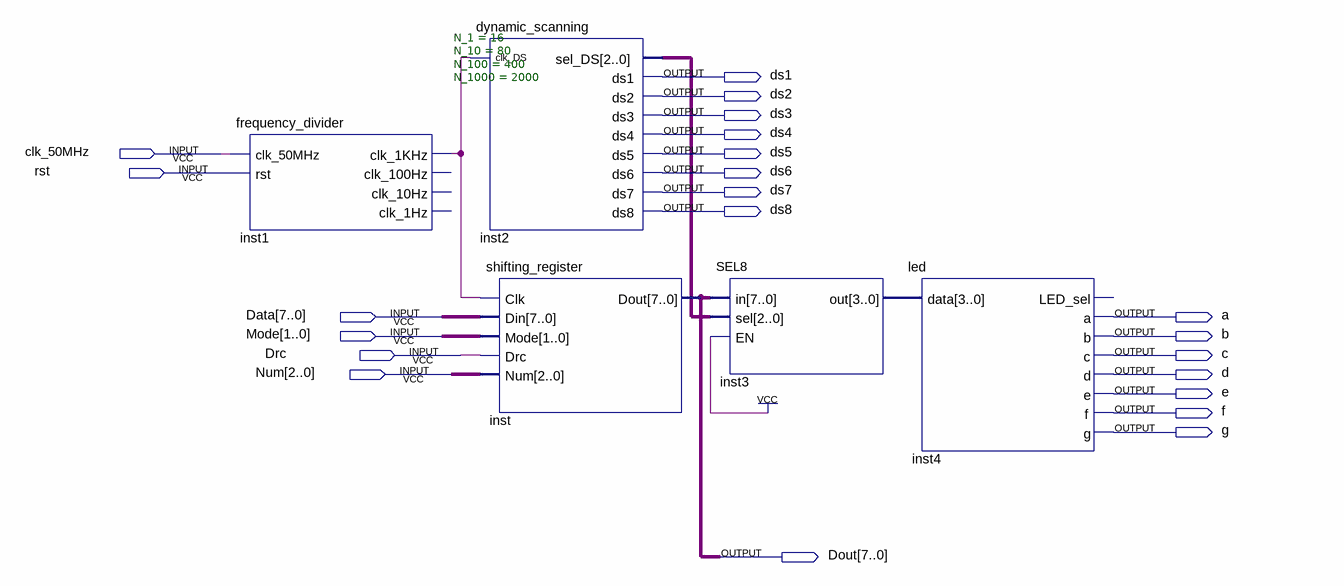
[diagram p0: schematic sheet]
// Quartus schematic project8.bdf as structural Verilog: 5 symbols, 22 pins
module project8 (
  input  clk_50MHz,
  input  rst,
  input  [7:0] Data,
  input  [1:0] Mode,
  input  Drc,
  input  [2:0] Num,
  output ds1,
  output ds2,
  output ds3,
  output ds4,
  output ds5,
  output ds6,
  output ds7,
  output ds8,
  output a,
  output b,
  output c,
  output d,
  output e,
  output f,
  output g,
  output [7:0] Dout
);

  wire inst1_clk_1khz;
  wire [2:0] inst2_sel_ds;
  wire [3:0] inst3_out;

  frequency_divider #(.N_1(16), .N_10(80), .N_100(400), .N_1000(2000)) inst1 (
    .clk_50MHz(clk_50MHz), .rst(rst), .clk_1KHz(inst1_clk_1khz));  // open: clk_100Hz, clk_10Hz, clk_1Hz
  dynamic_scanning inst2 (
    .clk_DS(inst1_clk_1khz), .sel_DS(inst2_sel_ds), .ds1(ds1), .ds2(ds2), .ds3(ds3), .ds4(ds4), .ds5(ds5),
    .ds6(ds6), .ds7(ds7), .ds8(ds8));
  shifting_register inst (.Clk(inst1_clk_1khz), .Din(Data), .Mode(Mode), .Drc(Drc), .Num(Num), .Dout(Dout));
  SEL8 inst3 (.in(Dout), .sel(inst2_sel_ds), .EN(1'b1), .out(inst3_out));
  led inst4 (.data(inst3_out), .a(a), .b(b), .c(c), .d(d), .e(e), .f(f), .g(g));  // open: LED_sel
endmodule
